# Altium schematic sheet Sensors.SchDoc
size A4; SheetNumber: 7; SheetTotal: 7
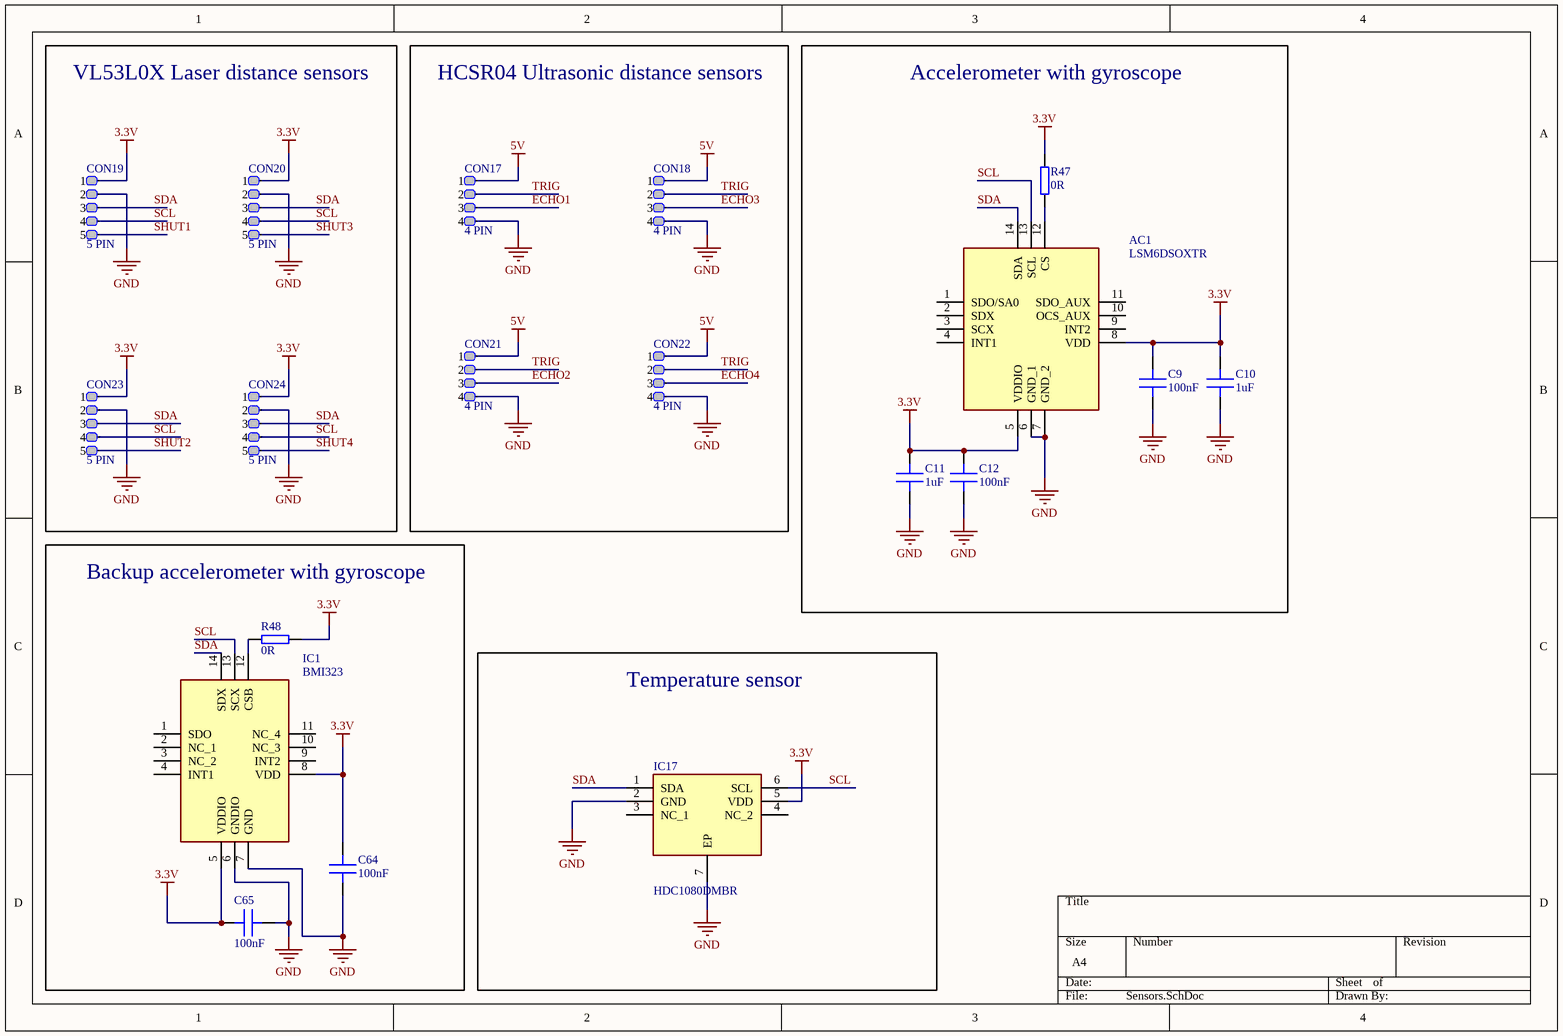
[diagram p0: Sensors.SchDoc]

## Parts
AC1  LSM6DSOXTR  [LGA-14_1]
C9  100nF  [C 0402]
C10  1uF  [C 0402]
C11  1uF  [C 0402]
C12  100nF  [C 0402]
C64  100nF  [C 0402]
C65  100nF  [C 0402]
CON17  4 PIN  [Goldpin 2.54 4P]
CON18  4 PIN  [Goldpin 2.54 4P]
CON19  5 PIN  [Goldpin 2.54mm  5Pin]
CON20  5 PIN  [Goldpin 2.54mm  5Pin]
CON21  4 PIN  [Goldpin 2.54 4P]
CON22  4 PIN  [Goldpin 2.54 4P]
CON23  5 PIN  [Goldpin 2.54mm  5Pin]
CON24  5 PIN  [Goldpin 2.54mm  5Pin]
IC1  BMI323  [BMI323]
IC17  HDC1080DMBR  [SON100P300X300X80-7N-D]
R47  0R  [R 0402]
R48  0R  [R 0402]

## Blocks framed on the sheet
VL53L0X Laser distance sensors: CON19 CON20 CON23 CON24
HCSR04 Ultrasonic distance sensors: CON17 CON18 CON21 CON22
Accelerometer with gyroscope: AC1 C9-C12 R47
Backup accelerometer with gyroscope: C64 C65 IC1 R48
Temperature sensor: IC17

## Nets
3.3V: AC1.5(VDDIO) AC1.8(VDD) C9.1 C10.1 C11.1 C12.1 C64.2 C65.1 CON19.1 CON20.1 CON23.1 CON24.1 IC1.5(VDDIO) IC1.8(VDD) IC17.5(VDD) R47.2 R48.2
5V: CON17.1 CON18.1 CON21.1 CON22.1
GND: AC1.6(GND_1) AC1.7(GND_2) C9.2 C10.2 C11.2 C12.2 C64.1 C65.2 CON17.4 CON18.4 CON19.2 CON20.2 CON21.4 CON22.4 CON23.2 CON24.2 IC1.6(GNDIO) IC1.7(GND) IC17.2(GND) IC17.7(EP)
ECHO1: CON17.3
ECHO2: CON21.3
ECHO3: CON18.3
ECHO4: CON22.3
SCL: AC1.13(SCL) CON19.4 CON20.4 CON23.4 CON24.4 IC1.13(SCX) IC17.6(SCL)
SDA: AC1.14(SDA) CON19.3 CON20.3 CON23.3 CON24.3 IC1.14(SDX) IC17.1(SDA)
SHUT1: CON19.5
SHUT2: CON23.5
SHUT3: CON20.5
SHUT4: CON24.5
TRIG: CON17.2 CON18.2 CON21.2 CON22.2
NetAC1_12: AC1.12(CS) R47.1
NetIC1_12: IC1.12(CSB) R48.1

Not connected (* = marked no-connect by the designer): AC1 1(SDO/SA0) 2(SDX) 3(SCX) 4(INT1) 9(INT2) 10(OCS_AUX) 11(SDO_AUX); IC1 1(SDO) 2(NC_1) 3(NC_2) 4(INT1) 9(INT2) 10(NC_3) 11(NC_4); IC17 3(NC_1) 4(NC_2)

## Library data of the parts
AC1 = LSM6DSOXTR: Accelerometer; Manufacturer_Name: STMicroelectronics; Datasheet Link: https://www.st.com/resource/en/datasheet/lsm6dsox.pdf; Manufacturer_Part_Number: LSM6DSOXTR; Mouser Part Number: 511-LSM6DSOXTR; Mouser Price/Stock: https://www.mouser.co.uk/ProductDetail/STMicroelectronics/LSM6DSOXTR?qs=l7cgNqFNU1i9dcjzItLpVQ%3D%3D; Arrow Part Number: LSM6DSOXTR; Arrow Price/Stock: https://www.arrow.com/en/products/lsm6dsoxtr/stmicroelectronics?region=europe
C9-C12 C64 C65 = Capacitor: MLCC Capacitor
IC1 = BMI323: Integrated Circuit; Manufacturer_Name: BOSCH; Datasheet Link: https://www.bosch-sensortec.com/media/boschsensortec/downloads/datasheets/bst-bmi323-ds000.pdf; Height: 0.87mm; Manufacturer_Part_Number: BMI323; Mouser Part Number: 262-BMI323; Mouser Price/Stock: https://www.mouser.co.uk/ProductDetail/Bosch-Sensortec/BMI323?qs=By6Nw2ByBD3%2FE1v0UqNQPQ%3D%3D; Arrow Part Number: BMI323; Arrow Price/Stock: https://www.arrow.com/en/products/bmi323/bosch?utm_currency=USD&region=nac
IC17 = HDC1080DMBR: Integrated Circuit; Manufacturer_Name: Texas Instruments; Datasheet Link: http://www.ti.com/lit/gpn/HDC1080; Height: 0.8mm; Manufacturer_Part_Number: HDC1080DMBR; Mouser Part Number: 595-HDC1080DMBR; Mouser Price/Stock: https://www.mouser.co.uk/ProductDetail/Texas-Instruments/HDC1080DMBR?qs=8%2FmU9qzJpL9OuhPLRSO9Vg%3D%3D; Arrow Part Number: HDC1080DMBR; Arrow Price/Stock: https://www.arrow.com/en/products/hdc1080dmbr/texas-instruments?region=nac
R47 R48 = Resistor: General pourpouse resistor